# Altium schematic sheet Science First iteration schematic.SchDoc
size 500 x 400 mm; SheetNumber: 1; SheetTotal: 1
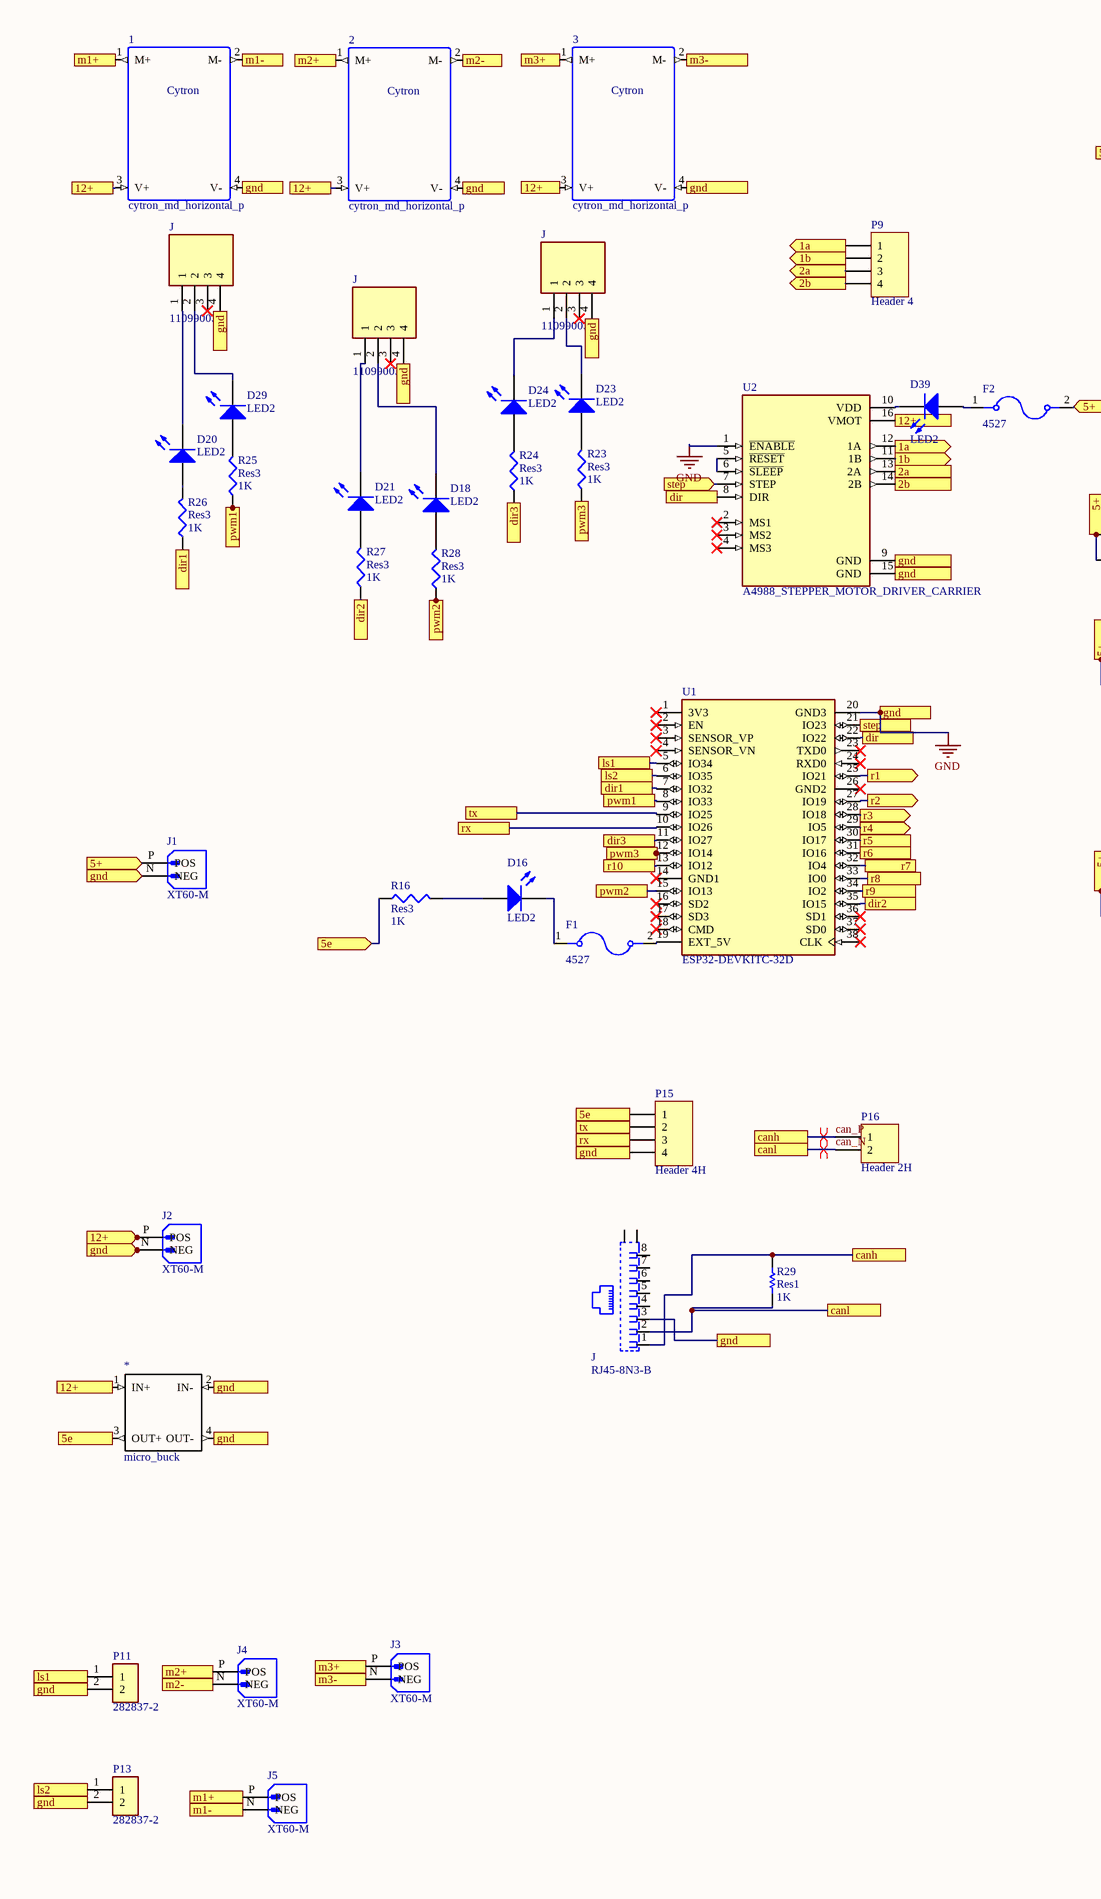
[diagram p0: Science First iteration schematic.SchDoc, left]
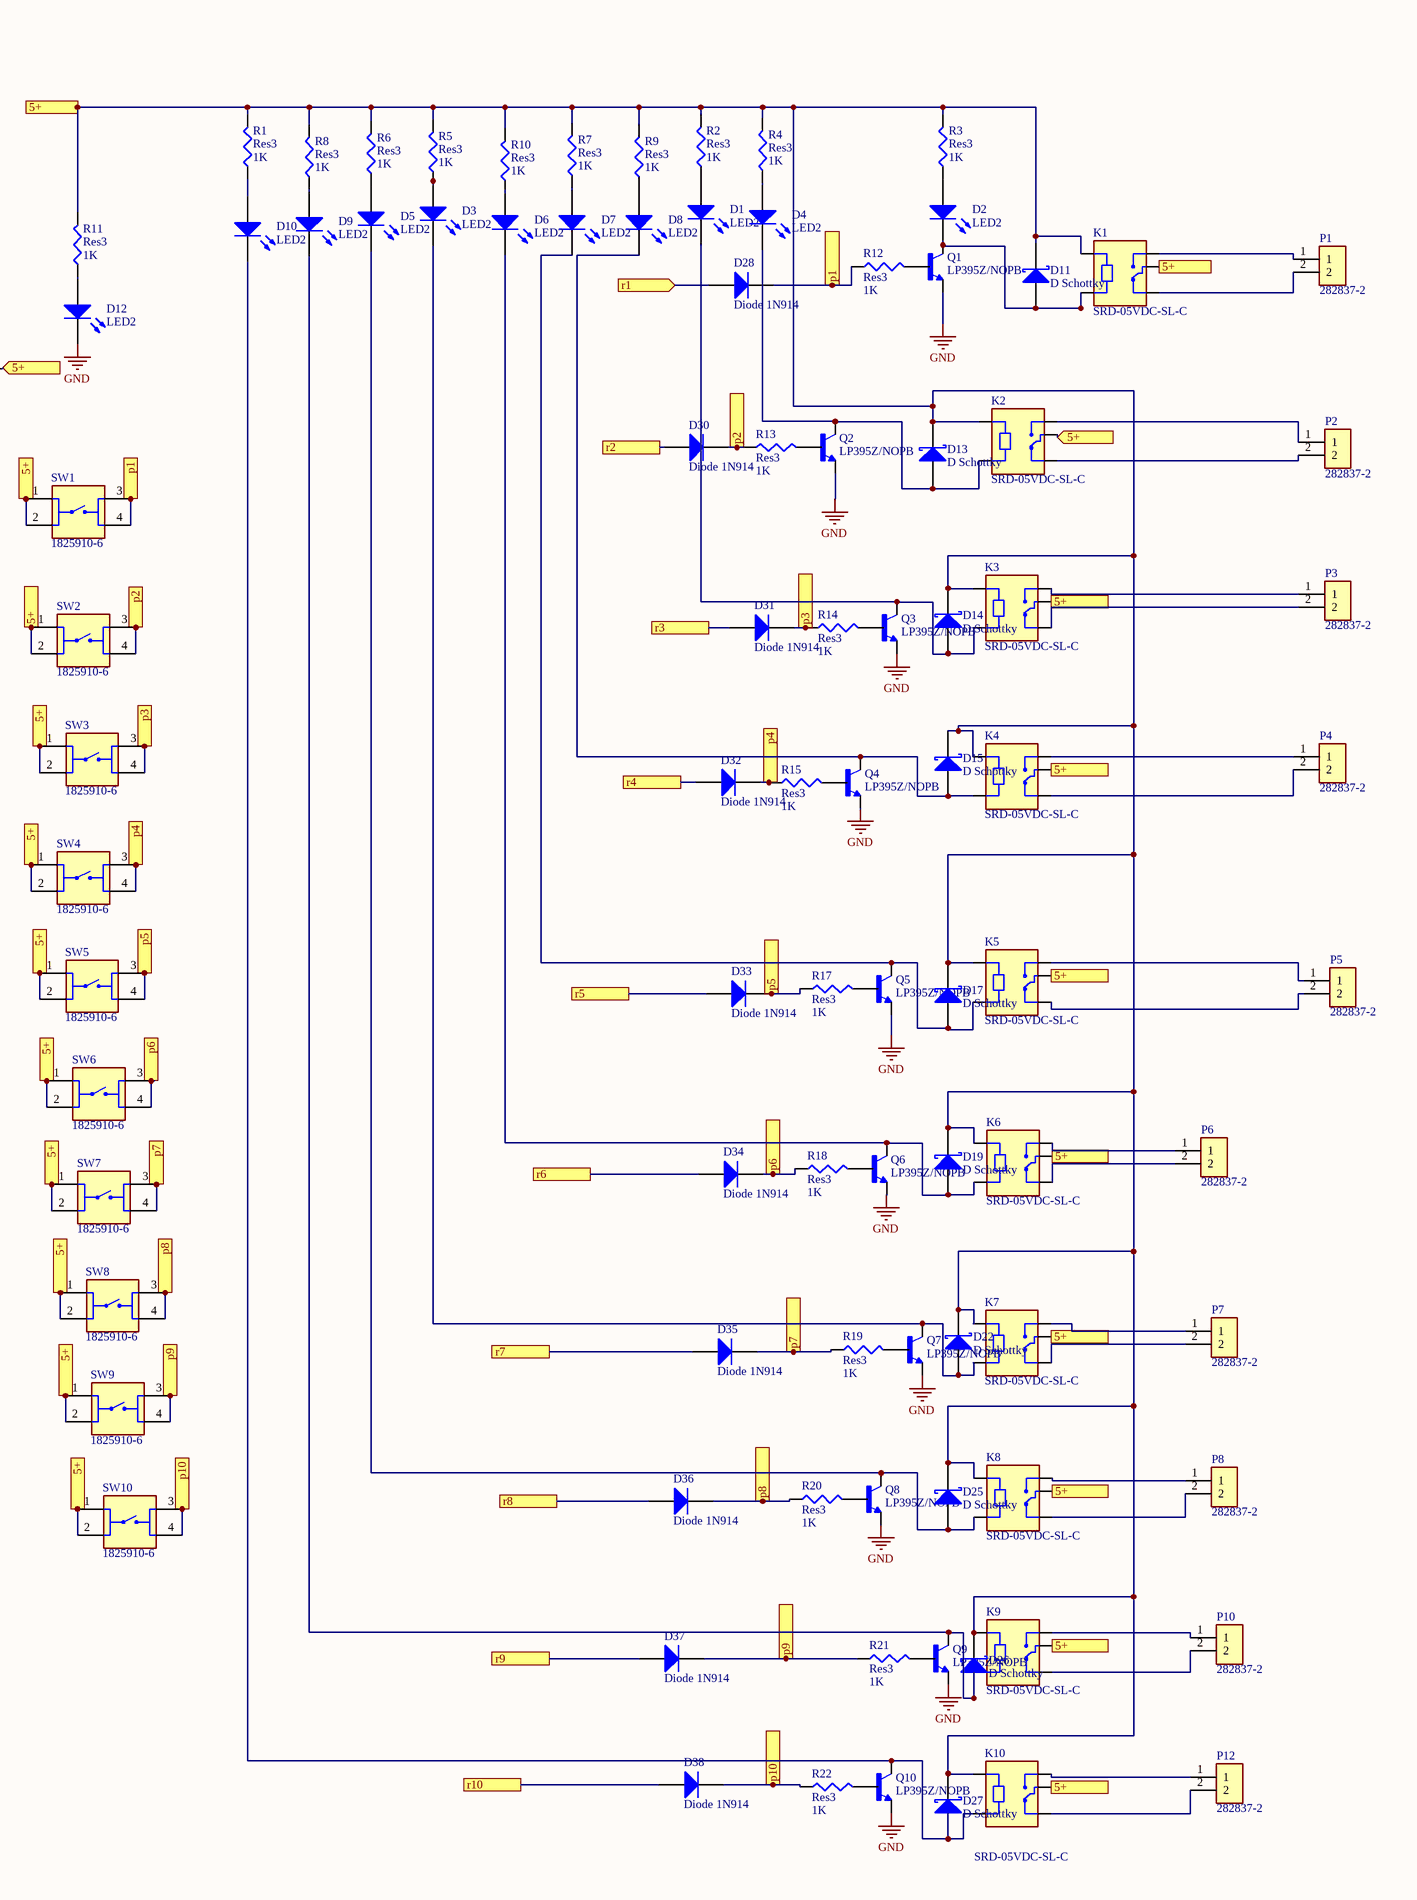
[diagram p1: Science First iteration schematic.SchDoc, right]

## Parts
(Parts that share a designator on the sheet are numbered #1, #2 ... from top to bottom, then left to right.)
1  cytron_md_horizontal_p  [Cytron_md]
2  cytron_md_horizontal_p  [Cytron_md]
3  cytron_md_horizontal_p  [Cytron_md]
*  micro_buck  [PCBComponent_1]
D1  LED2  [3.2X1.6X1.1]
D2  LED2  [3.2X1.6X1.1]
D3  LED2  [3.2X1.6X1.1]
D4  LED2  [3.2X1.6X1.1]
D5  LED2  [3.2X1.6X1.1]
D6  LED2  [3.2X1.6X1.1]
D7  LED2  [3.2X1.6X1.1]
D8  LED2  [3.2X1.6X1.1]
D9  LED2  [3.2X1.6X1.1]
D10  LED2  [3.2X1.6X1.1]
D11  D Schottky  [SMB]
D12  LED2  [3.2X1.6X1.1]
D13  D Schottky  [SMB]
D14  D Schottky  [SMB]
D15  D Schottky  [SMB]
D16  LED2  [3.2X1.6X1.1]
D17  D Schottky  [SMB]
D18  LED2  [3.2X1.6X1.1]
D19  D Schottky  [SMB]
D20  LED2  [3.2X1.6X1.1]
D21  LED2  [3.2X1.6X1.1]
D22  D Schottky  [SMB]
D23  LED2  [3.2X1.6X1.1]
D24  LED2  [3.2X1.6X1.1]
D25  D Schottky  [SMB]
D26  D Schottky  [SMB]
D27  D Schottky  [SMB]
D28  Diode 1N914  [DO-35]
D29  LED2  [3.2X1.6X1.1]
D30  Diode 1N914  [DO-35]
D31  Diode 1N914  [DO-35]
D32  Diode 1N914  [DO-35]
D33  Diode 1N914  [DO-35]
D34  Diode 1N914  [DO-35]
D35  Diode 1N914  [DO-35]
D36  Diode 1N914  [DO-35]
D37  Diode 1N914  [DO-35]
D38  Diode 1N914  [DO-35]
D39  LED2  [3.2X1.6X1.1]
F1  4527  [FUSE_4527]
F2  4527  [FUSE_4527]
J1  XT60-M  [AMASS_XT60-M]
J2  XT60-M  [AMASS_XT60-M]
J3  XT60-M  [AMASS_XT60-M]
J4  XT60-M  [AMASS_XT60-M]
J5  XT60-M  [AMASS_XT60-M]
J#1  110990030  [SEEED_110990030]
J#2  110990030  [SEEED_110990030]
J#3  110990030  [SEEED_110990030]
J#4  RJ45-8N3-B  [TE_RJ45-8N3-B]
K1  SRD-05VDC-SL-C  [RELAY_SRD-05VDC-SL-C]
K2  SRD-05VDC-SL-C  [RELAY_SRD-05VDC-SL-C]
K3  SRD-05VDC-SL-C  [RELAY_SRD-05VDC-SL-C]
K4  SRD-05VDC-SL-C  [RELAY_SRD-05VDC-SL-C]
K5  SRD-05VDC-SL-C  [RELAY_SRD-05VDC-SL-C]
K6  SRD-05VDC-SL-C  [RELAY_SRD-05VDC-SL-C]
K7  SRD-05VDC-SL-C  [RELAY_SRD-05VDC-SL-C]
K8  SRD-05VDC-SL-C  [RELAY_SRD-05VDC-SL-C]
K9  SRD-05VDC-SL-C  [RELAY_SRD-05VDC-SL-C]
K10  SRD-05VDC-SL-C  [RELAY_SRD-05VDC-SL-C]
P1  282837-2  [TE_282837-2]
P2  282837-2  [TE_282837-2]
P3  282837-2  [TE_282837-2]
P4  282837-2  [TE_282837-2]
P5  282837-2  [TE_282837-2]
P6  282837-2  [TE_282837-2]
P7  282837-2  [TE_282837-2]
P8  282837-2  [TE_282837-2]
P9  Header 4  [HDR1X4]
P10  282837-2  [TE_282837-2]
P11  282837-2  [TE_282837-2]
P12  282837-2  [TE_282837-2]
P13  282837-2  [TE_282837-2]
P15  Header 4H  [HDR1X4H]
P16  Header 2H  [HDR1X2H]
Q1  LP395Z/NOPB  [TO-92]
Q2  LP395Z/NOPB  [TO-92]
Q3  LP395Z/NOPB  [TO-92]
Q4  LP395Z/NOPB  [TO-92]
Q5  LP395Z/NOPB  [TO-92]
Q6  LP395Z/NOPB  [TO-92]
Q7  LP395Z/NOPB  [TO-92]
Q8  LP395Z/NOPB  [TO-92]
Q9  LP395Z/NOPB  [TO-92]
Q10  LP395Z/NOPB  [TO-92]
R1  Res3  value 1K  [12Z-2010]
R2  Res3  value 1K  [14-1210]
R3  Res3  value 1K  [14-1210]
R4  Res3  value 1K  [14-1210]
R5  Res3  value 1K  [14-1210]
R6  Res3  value 1K  [14-1210]
R7  Res3  value 1K  [14-1210]
R8  Res3  value 1K  [14-1210]
R9  Res3  value 1K  [14-1210]
R10  Res3  value 1K  [14-1210]
R11  Res3  value 1K  [14-1210]
R12  Res3  value 1K  [14-1210]
R13  Res3  value 1K  [14-1210]
R14  Res3  value 1K  [14-1210]
R15  Res3  value 1K  [14-1210]
R16  Res3  value 1K  [14-1210]
R17  Res3  value 1K  [14-1210]
R18  Res3  value 1K  [14-1210]
R19  Res3  value 1K  [14-1210]
R20  Res3  value 1K  [14-1210]
R21  Res3  value 1K  [14-1210]
R22  Res3  value 1K  [14-1210]
R23  Res3  value 1K  [14-1210]
R24  Res3  value 1K  [14-1210]
R25  Res3  value 1K  [14-1210]
R26  Res3  value 1K  [14-1210]
R27  Res3  value 1K  [14-1210]
R28  Res3  value 1K  [14-1210]
R29  Res1  value 1K  [AXIAL-0.3]
SW1  1825910-6  [SW_1825910-6-4]
SW2  1825910-6  [SW_1825910-6-4]
SW3  1825910-6  [SW_1825910-6-4]
SW4  1825910-6  [SW_1825910-6-4]
SW5  1825910-6  [SW_1825910-6-4]
SW6  1825910-6  [SW_1825910-6-4]
SW7  1825910-6  [SW_1825910-6-4]
SW8  1825910-6  [SW_1825910-6-4]
SW9  1825910-6  [SW_1825910-6-4]
SW10  1825910-6  [SW_1825910-6-4]
U1  ESP32-DEVKITC-32D  [MODULE_ESP32-DEVKITC-32D]
U2  A4988_STEPPER_MOTOR_DRIVER_CARRIER  [MODULE_A4988_STEPPER_MOTOR_DRIVER_CARRIER]

## Ports
1a (out), 1b (out), 2a (out), 2b (out), 5+, 5+ (in), 5e, 5e (in), 5e (out), 12+, 12+ (in), canh, canl, dir, dir1, dir2, dir3, dir (in), gnd, gnd (in), gnd (out), ls1, ls2, m1+, m1-, m2+, m2-, m3+, m3-, p1, p2, p3, p4, p5, p6, p7, p8, p9, p10, pwm1, pwm2, pwm3, r1 (in), r1 (out), r2, r2 (out), r3, r3 (out), r4, r4 (out), r5, r6, r7, r8, r9, r10, rx, step, step (in), tx

## Nets
GND: 1.4(V-) 2.4(V-) 3.4(V-) *.2(IN-) *.4(OUT-) D12.2(K) J1.N(NEG) J2.N(NEG) J#1.4 J#2.4 J#3.4 J#4.3 P11.2 P13.2 P15.4 Q1.1(E) Q2.1(E) Q3.1(E) Q4.1(E) Q5.1(E) Q6.1(E) Q7.1(E) Q8.1(E) Q9.1(E) Q10.1(E) U1.20(GND3) U2.1(~{ENABLE}) U2.9(GND) U2.15(GND) ; port gnd
1a: P9.1 U2.12(1A) ; port 1a
1b: P9.2 U2.11(1B) ; port 1b
2a: P9.3 U2.13(2A) ; port 2a
2b: P9.4 U2.14(2B) ; port 2b
5+: D11.2(K) D13.2(K) D14.2(K) D15.2(K) D17.2(K) D19.2(K) D22.2(K) D25.2(K) D26.2(K) D27.2(K) F2.2 J1.P(POS) K1.A1 K1.COM K2.A1 K2.COM K3.A1 K3.COM K4.A1 K4.COM K5.A1 K5.COM K6.A1 K6.COM K7.A1 K7.COM K8.A1 K8.COM K9.A1 K9.COM K10.A1 K10.COM R1.2 R2.2 R3.2 R4.2 R5.2 R6.2 R7.2 R8.2 R9.2 R10.2 R11.2 SW1.1 SW1.2 SW2.1 SW2.2 SW3.1 SW3.2 SW4.1 SW4.2 SW5.1 SW5.2 SW6.1 SW6.2 SW7.1 SW7.2 SW8.1 SW8.2 SW9.1 SW9.2 SW10.1 SW10.2 ; port 5+
5e: *.3(OUT+) P15.1 R16.1 ; port 5e
12+: 1.3(V+) 2.3(V+) 3.3(V+) *.1(IN+) J2.P(POS) U2.16(VMOT) ; port 12+
can_N: J#4.2 P16.2 R29.1 ; port canl
can_P: J#4.1 P16.1 R29.2 ; port canh
dir: U1.22(IO22) U2.8(DIR) ; port dir
dir1: R26.1 U1.7(IO32) ; port dir1
dir2: R27.1 U1.35(IO15) ; port dir2
dir3: R24.1 U1.11(IO27) ; port dir3
ls1: P11.1 U1.5(IO34) ; port ls1
ls2: P13.1 U1.6(IO35) ; port ls2
m1+: 1.1(M+) J5.P(POS) ; port m1+
m1-: 1.2(M-) J5.N(NEG) ; port m1-
m2+: 2.1(M+) J4.P(POS) ; port m2+
m2-: 2.2(M-) J4.N(NEG) ; port m2-
m3+: 3.1(M+) J3.P(POS) ; port m3+
m3-: 3.2(M-) J3.N(NEG) ; port m3-
p1: D28.2(K) R12.1 SW1.3 SW1.4 ; port p1
p2: D30.2(K) R13.1 SW2.3 SW2.4 ; port p2
p3: D31.2(K) R14.1 SW3.3 SW3.4 ; port p3
p4: D32.2(K) R15.1 SW4.3 SW4.4 ; port p4
p5: D33.2(K) R17.1 SW5.3 SW5.4 ; port p5
p6: D34.2(K) R18.1 SW6.3 SW6.4 ; port p6
p7: D35.2(K) R19.1 SW7.3 SW7.4 ; port p7
p8: D36.2(K) R20.1 SW8.3 SW8.4 ; port p8
p9: D37.2(K) R21.1 SW9.3 SW9.4 ; port p9
p10: D38.2(K) R22.1 SW10.3 SW10.4 ; port p10
pwm1: R25.1 U1.8(IO33) ; port pwm1
pwm2: R28.1 U1.15(IO13) ; port pwm2
pwm3: R23.1 U1.12(IO14) ; port pwm3
r1: D28.1(A) U1.25(IO21) ; port r1
r2: D30.1(A) U1.27(IO19) ; port r2
r3: D31.1(A) U1.28(IO18) ; port r3
r4: D32.1(A) U1.29(IO5) ; port r4
r5: D33.1(A) U1.30(IO17) ; port r5
r6: D34.1(A) U1.31(IO16) ; port r6
r7: D35.1(A) U1.32(IO4) ; port r7
r8: D36.1(A) U1.33(IO0) ; port r8
r9: D37.1(A) U1.34(IO2) ; port r9
r10: D38.1(A) U1.13(IO12) ; port r10
rx: P15.3 U1.10(IO26) ; port rx
step: U1.21(IO23) U2.7(STEP) ; port step
tx: P15.2 U1.9(IO25) ; port tx
NetD1_1: D1.1(A) R2.1
NetD1_2: D1.2(K) D14.1(A) K3.A2 Q3.3(C)
NetD2_1: D2.1(A) R3.1
NetD2_2: D2.2(K) D11.1(A) K1.A2 Q1.3(C)
NetD3_1: D3.1(A) R5.1
NetD3_2: D3.2(K) D22.1(A) K7.A2 Q7.3(C)
NetD4_1: D4.1(A) R4.1
NetD4_2: D4.2(K) D13.1(A) K2.A2 Q2.3(C)
NetD5_1: D5.1(A) R6.1
NetD5_2: D5.2(K) D25.1(A) K8.A2 Q8.3(C)
NetD6_1: D6.1(A) R10.1
NetD6_2: D6.2(K) D19.1(A) K6.A2 Q6.3(C)
NetD7_1: D7.1(A) R7.1
NetD7_2: D7.2(K) D17.1(A) K5.A2 Q5.3(C)
NetD8_1: D8.1(A) R9.1
NetD8_2: D8.2(K) D15.1(A) K4.A2 Q4.3(C)
NetD9_1: D9.1(A) R8.1
NetD9_2: D9.2(K) D26.1(A) K9.A2 Q9.3(C)
NetD10_1: D10.1(A) R1.1
NetD10_2: D10.2(K) D27.1(A) K10.A2 Q10.3(C)
NetD12_1: D12.1(A) R11.1
NetD16_1: D16.1(A) R16.2
NetD16_2: D16.2(K) F1.1
NetD18_1: D18.1(A) R28.2
NetD18_2: D18.2(K) J#3.2
NetD20_1: D20.1(A) R26.2
NetD20_2: D20.2(K) J#1.1
NetD21_1: D21.1(A) R27.2
NetD21_2: D21.2(K) J#3.1
NetD23_1: D23.1(A) R23.2
NetD23_2: D23.2(K) J#2.2
NetD24_1: D24.1(A) R24.2
NetD24_2: D24.2(K) J#2.1
NetD29_1: D29.1(A) R25.2
NetD29_2: D29.2(K) J#1.2
NetD39_1: D39.1(A) F2.1
NetD39_2: D39.2(K) U2.10(VDD)
NetF1_2: F1.2 U1.19(EXT_5V)
NetK1_NC: K1.NC P1.2
NetK1_NO: K1.NO P1.1
NetK2_NC: K2.NC P2.2
NetK2_NO: K2.NO P2.1
NetK3_NC: K3.NC P3.2
NetK3_NO: K3.NO P3.1
NetK4_NC: K4.NC P4.2
NetK4_NO: K4.NO P4.1
NetK5_NC: K5.NC P5.2
NetK5_NO: K5.NO P5.1
NetK6_NC: K6.NC P6.2
NetK6_NO: K6.NO P6.1
NetK7_NC: K7.NC P7.2
NetK7_NO: K7.NO P7.1
NetK8_NC: K8.NC P8.2
NetK8_NO: K8.NO P8.1
NetK9_NC: K9.NC P10.2
NetK9_NO: K9.NO P10.1
NetK10_NC: K10.NC P12.2
NetK10_NO: K10.NO P12.1
NetQ1_2: Q1.2(B) R12.2
NetQ2_2: Q2.2(B) R13.2
NetQ3_2: Q3.2(B) R14.2
NetQ4_2: Q4.2(B) R15.2
NetQ5_2: Q5.2(B) R17.2
NetQ6_2: Q6.2(B) R18.2
NetQ7_2: Q7.2(B) R19.2
NetQ8_2: Q8.2(B) R20.2
NetQ9_2: Q9.2(B) R21.2
NetQ10_2: Q10.2(B) R22.2
NetU2_5: U2.5(~{RESET}) U2.6(~{SLEEP})

Not connected (* = marked no-connect by the designer): J#1 3*; J#2 3*; J#3 3*; J#4 4 5 6 7 8 9(S1) 10(S2); U1 1(3V3)* 2(EN)* 3(SENSOR_VP)* 4(SENSOR_VN)* 14(GND1)* 16(SD2)* 17(SD3)* 18(CMD)* 23(TXD0)* 24(RXD0)* 26(GND2)* 36(SD1)* 37(SD0)* 38(CLK)*; U2 2(MS1)* 3(MS2)* 4(MS3)*

## Layout directives
differential pair: can_N, can_P

## Notes on the sheet
- (in symbol cytron_md_horizontal_p) Cytron

## Library data of the parts
* = Component_1
D1-D10 D12 D16 D18 D20 D21 D23 D24 D29 D39 = LED2: Typical RED, GREEN, YELLOW, AMBER GaAs LED; Published: 8-Jun-2000; LatestRevisionDate: 17-Jul-2002; LatestRevisionNote: Re-released for DXP Platform.; PackageVersion: Feb-2002; PackageReference: 3.2X1.6X1.1; Publisher: Altium Limited; PackageDescription: SM LED; 2 Flat Leads
D11 D13-D15 D17 D19 D22 D25-D27 = D Schottky: Schottky Diode; Published: 8-Jun-2000; LatestRevisionDate: 17-Jul-2002; LatestRevisionNote: Re-released for DXP Platform.; PackageReference: SMB; Publisher: Altium Limited; PackageDescription: DO-214-AA/SMB; 2 C-Bend Leads; Body 5.3 x 3.6 mm, inc. leads (LxW); Code_JEDEC: DO-214-AA
D28 D30-D38 = Diode 1N914: High Conductance Fast Diode; Published: 8-Jun-2000; LatestRevisionDate: 17-Jul-2002; LatestRevisionNote: Re-released for DXP Platform.; DatasheetVersion: 1997; PackageReference: DO-35; Publisher: Altium Limited; PackageDescription: Diode, Axial; Body 3.8 x 1.9 mm (LxDia. max), Lead Dia. 0.53 mm (max); Code_JEDEC: DO-204-AH; ComponentLink1Description: Manufacturer Link; ComponentLink1URL: http://www.fairchildsemi.com/; ComponentLink2Description: Datasheet; ComponentLink2URL: http://www.fairchildsemi.com/ds/1N%2F1N4448.pdf
F1 F2 = 4527: Fuseholder; 5 A; 250 V; Nylon; Base only; Brass, Tin Plate (Contact); Value: *; MP: 4527; Package: None; Availability: Unavailable; Price: None
J1-J5 = XT60-M: Plug; DC supply; XT60; male; PIN: 2; for cable; soldered; 30A; 500V; MF: AMASS; Package: Package; Availability: Not in stock; SnapEDA_Link: https://www.snapeda.com/parts/XT60-M/AMASS/view-part/?ref=snap; Check_prices: https://www.snapeda.com/parts/XT60-M/AMASS/view-part/?ref=eda; MP: XT60-M; Price: None; Value: *
J#1-J#3 = 110990030: GROVE 2MM 4PIN VERT CONN 10PCS; MF: Seeed Technology; Arrow_Electronics-Purchase-URL: https://snapeda.com/shop?store=Arrow+Electronics&id=583576; Availability: Good; Package: None; Price: None; Mouser-Purchase-URL: https://snapeda.com/shop?store=Mouser&id=583576; MP: 110990030; SnapEDA_Link: https://www.snapeda.com/parts/110990030/Seeed%20Technology%20Co.,%20Ltd/view-part/583576/?ref=snap; Value: *
J#4 = RJ45-8N3-B: Connector RJ-45 Female 8 Position 2.54mm Solder Right Angle Through Hole 8 Terminal; MF: TE Connectivity; MP: RJ45-8N3-B; Price: None; Availability: Unavailable; Package: None; SnapEDA_Link: https://www.snapeda.com/parts/RJ45-8N3-B/TE%20Connectivity%20Corcom%20Filters/view-part/2770351/?ref=snap; TE_purchase_URL: https://www.te.com/usa-en/product-1-6609212-3.html?te_bu=Cor&te_type=disp&te_campaign=seda_glo_cor-seda-global-disp-prtnr-fy19-seda-model-bom-cta_sma-317_1&elqCampaignId=32493; Value: *
K1-K10 = SRD-05VDC-SL-C: 5V Trigger Relay Module For Arduino And Raspberry Pi 5V Trigger Relay Module For Arduino And Raspberry Pi; MF: Songle Relay; Value: *; Price: None; Package: NON STANDARD-5 Songle Relay; Availability: Not in stock; Check_prices: https://www.snapeda.com/parts/SRD-05VDC-SL-C/Songle+Relay/view-part/?ref=eda; MP: SRD-05VDC-SL-C; SnapEDA_Link: https://www.snapeda.com/parts/SRD-05VDC-SL-C/Songle+Relay/view-part/?ref=snap
P1-P8 P10-P13 = 282837-2: TERM BLOCK 5.08MM 2POS SIDE ENTY; Value: *; Availability: Unavailable; Price: None; MP: 282837-2; Package: None
P9 = Header 4: Header, 4-Pin; LatestRevisionDate: 17-Jul-2002; LatestRevisionNote: Re-released for DXP Platform.; Publisher: Altium Limited
P15 = Header 4H: Header, 4-Pin, Right Angle; LatestRevisionDate: 17-Jul-2002; LatestRevisionNote: Re-released for DXP Platform.; Publisher: Altium Limited
P16 = Header 2H: Header, 2-Pin, Right Angle; LatestRevisionDate: 17-Jul-2002; LatestRevisionNote: Re-released for DXP Platform.; Publisher: Altium Limited
Q1-Q10 = LP395Z/NOPB: 36-V power transistor 3-TO-92 -40 to 125; MF: Texas Instruments; Purchase-URL: https://pricing.snapeda.com/search/part/LP395Z/NOPB/?ref=eda; MP: LP395Z/NOPB; Package: TO-92-3 Texas Instruments; SnapEDA_Link: https://www.snapeda.com/parts/LP395Z/NOPB/Texas%20Instruments/view-part/809923/?ref=snap; Price: None; Availability: Good; Value: *; Check_prices: https://www.snapeda.com/parts/LP395Z/NOPB/Texas%20Instruments/view-part/809923/?ref=eda
R1-R28 = Res3: Resistor; Published: 8-Jun-2000; LatestRevisionDate: 29-May-2009; LatestRevisionNote: IPC-7351 Footprint Added.; PackageReference: J1-0603; Publisher: Altium Limited; PackageDescription: Chip Resistor
R29 = Res1: Resistor; Published: 8-Jun-2000; LatestRevisionDate: 17-Jul-2002; LatestRevisionNote: Re-released for DXP Platform.; PackageReference: AXIAL-0.3; Publisher: Altium Limited; PackageDescription: Axial Device, Thru-Hole; 2 Leads; 0.3 in Pin Spacing
SW1-SW10 = 1825910-6: Switch Tactile OFF (ON) SPST Round Button PC Pins 0.05A 24VDC 100000Cycles 1.57N Thru-Hole Loose; Package: None; MP: 1825910-6; Value: *; Price: None; Availability: Unavailable
U1 = ESP32-DEVKITC-32D: Eval Board For Esp-Wroom-32; Package: None; Availability: Unavailable; Value: *; MP: ESP32-DEVKITC-32D; Price: None
U2 = A4988_STEPPER_MOTOR_DRIVER_CARRIER: Stepper motor controler; IC: A4988; 1A; Uin mot: 8Ã·35V; Package: None; Availability: Unavailable; Value: *; MP: A4988_STEPPER_MOTOR_DRIVER_CARRIER; Price: None